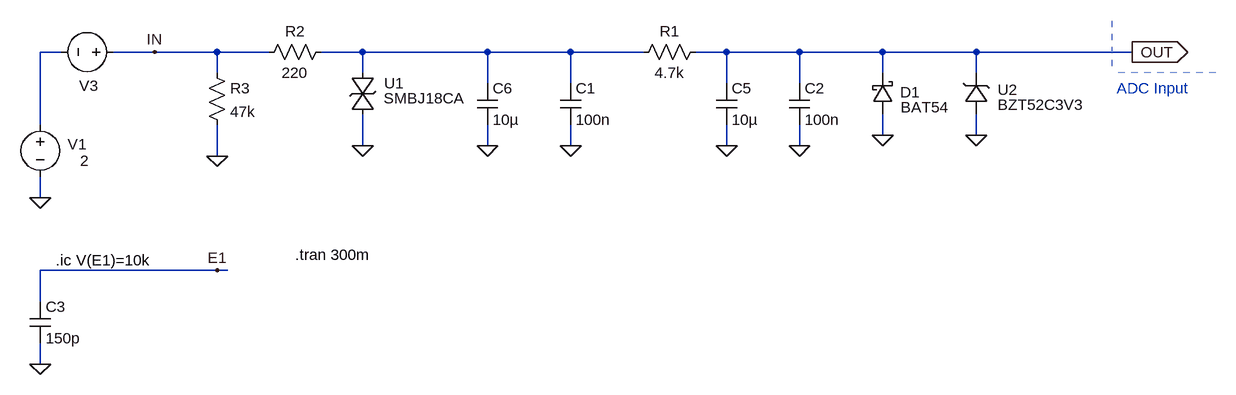
[diagram p0: schematic v2.0.asc]
v2.0.asc, the LTspice schematic file:
Version 4.1
SHEET 1 1556 680
WIRE -480 128 -512 128
WIRE -336 128 -400 128
WIRE -240 128 -336 128
WIRE -160 128 -240 128
WIRE -16 128 -80 128
WIRE 176 128 -16 128
WIRE 304 128 176 128
WIRE 416 128 304 128
WIRE 544 128 496 128
WIRE 656 128 544 128
WIRE 784 128 656 128
WIRE 928 128 784 128
WIRE 1168 128 928 128
WIRE -240 160 -240 128
WIRE -16 160 -16 128
WIRE 784 160 784 128
WIRE 928 160 928 128
WIRE 176 176 176 128
WIRE 304 176 304 128
WIRE 544 176 544 128
WIRE 656 176 656 128
WIRE -512 240 -512 128
WIRE 784 256 784 224
WIRE 928 256 928 224
WIRE -16 272 -16 224
WIRE 176 272 176 240
WIRE 304 272 304 240
WIRE 544 272 544 240
WIRE 656 272 656 240
WIRE -240 288 -240 240
WIRE -512 352 -512 320
WIRE -240 464 -512 464
WIRE -224 464 -240 464
WIRE -512 512 -512 464
WIRE -512 608 -512 576
FLAG -512 352 0
FLAG 784 256 0
FLAG 656 272 0
FLAG -336 128 IN
FLAG 1168 128 OUT
IOPIN 1168 128 Out
FLAG 304 272 0
FLAG -240 288 0
FLAG 544 272 0
FLAG 176 272 0
FLAG 928 256 0
FLAG -16 272 0
FLAG -512 608 0
FLAG -240 464 E1
SYMBOL voltage -512 224 R0
WINDOW 0 42 46 Left 2
WINDOW 3 75 71 Right 2
WINDOW 123 0 0 Left 0
WINDOW 39 0 0 Left 0
SYMATTR InstName V1
SYMATTR Value 2
SYMBOL res 400 144 R270
WINDOW 0 32 56 VTop 2
WINDOW 3 0 56 VBottom 2
SYMATTR InstName R1
SYMATTR Value 4.7k
SYMBOL cap 640 176 R0
SYMATTR InstName C2
SYMATTR Value 100n
SYMBOL voltage -384 128 R90
WINDOW 0 52 39 VRight 2
WINDOW 3 -51 -29 Invisible 2
WINDOW 123 0 0 Left 0
WINDOW 39 0 0 Left 0
SYMATTR InstName V3
SYMATTR Value PULSE(0 0.2 50m 10n 10n {0.5/20k} {1/20k} 200)
SYMBOL res -176 144 R270
WINDOW 0 32 56 VTop 2
WINDOW 3 0 56 VBottom 2
SYMATTR InstName R2
SYMATTR Value 220
SYMBOL cap 288 176 R0
SYMATTR InstName C1
SYMATTR Value 100n
SYMBOL res -256 144 R0
SYMATTR InstName R3
SYMATTR Value 47k
SYMBOL cap 528 176 R0
SYMATTR InstName C5
SYMATTR Value 10µ
SYMBOL cap 160 176 R0
SYMATTR InstName C6
SYMATTR Value 10µ
SYMBOL MyLib\\Diode_Zener\\BZT52C3V3 912 224 M180
WINDOW 0 49 38 Left 2
WINDOW 38 49 15 Left 2
SYMATTR InstName U2
SYMBOL schottky 768 224 M180
WINDOW 0 43 34 Left 2
WINDOW 3 44 11 Left 2
SYMATTR InstName D1
SYMATTR Value BAT54
SYMBOL MyLib\\Diode_TVS\\SMAJ33CA -32 160 R0
SYMATTR InstName U1
SYMATTR SpiceModel SMBJ18CA
SYMBOL cap -528 512 R0
SYMATTR InstName C3
SYMATTR Value 150p
SYMATTR SpiceLine Rser=330
TEXT -120 440 Left 2 !.tran 300m
TEXT 1144 184 Left 2 ;ADC Input
TEXT -488 448 Left 2 !.ic V(E1)=10k
LINE Normal 1296 160 1136 160 2
LINE Normal 1136 80 1136 160 2

The netlist it stands for:
* v2.0.asc
V1 N001 0 2
R1 N002 OUT 4.7k
C2 OUT 0 100n
V3 IN N001 PULSE(0 0.2 50m 10n 10n {0.5/20k} {1/20k} 200)
R2 IN N002 220
C1 N002 0 100n
R3 IN 0 47k
C5 OUT 0 10µ
C6 N002 0 10µ
X§U2 0 OUT BZT52C3V3  ; pins + -
D1 0 OUT BAT54
X§U1 N002 0 SMBJ18CA  ; pins + -
C3 E1 0 150p Rser=330
.model D D
.lib standard.dio
.tran 300m
* ADC Input
.ic V(E1)=10k
.lib MyLib/Diode_Zener/BZT52C3V3.lib
.lib MyLib/Diode_TVS/_TVS_Zetex.lib
.backanno
.end